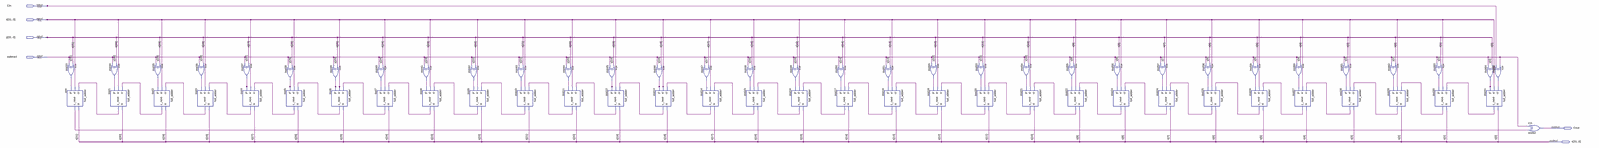
[diagram p0: schematic sheet, whole]
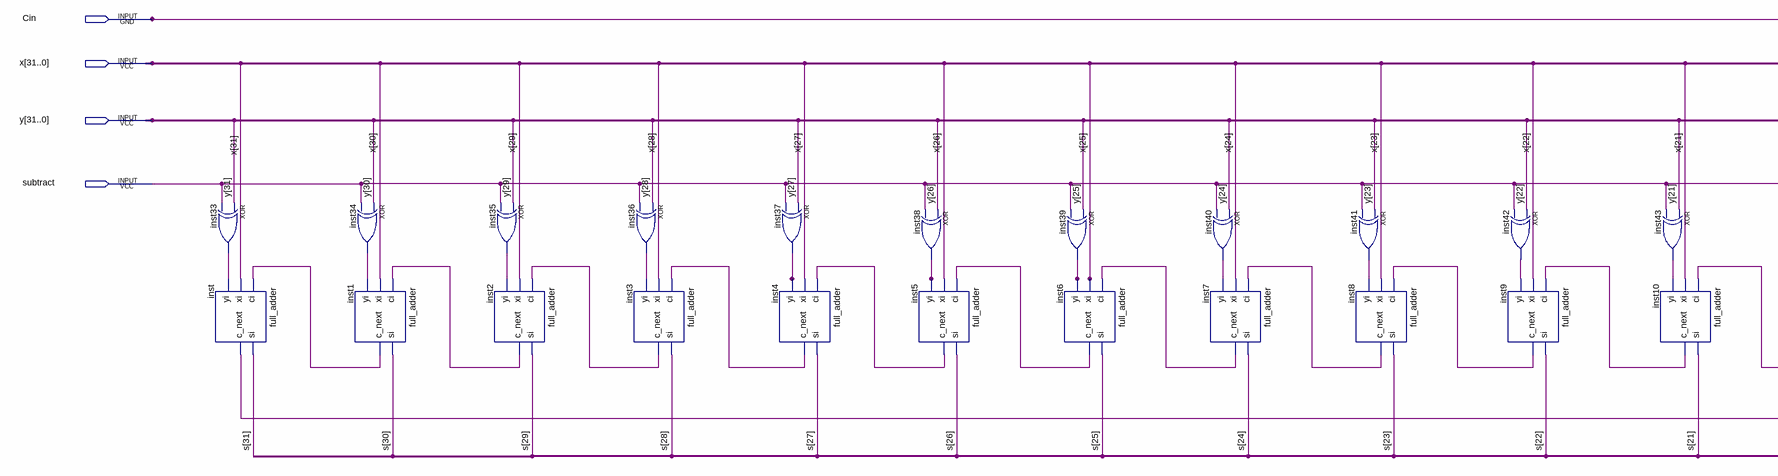
[diagram p1: schematic sheet, left part]
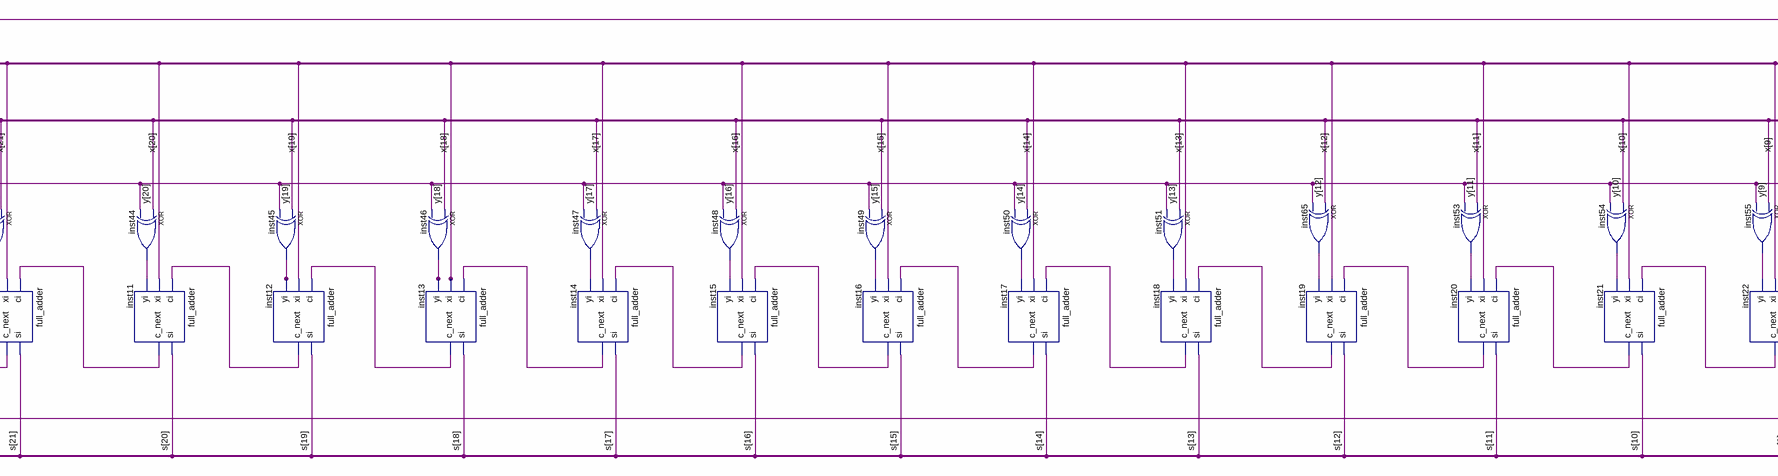
[diagram p2: schematic sheet, centre part]
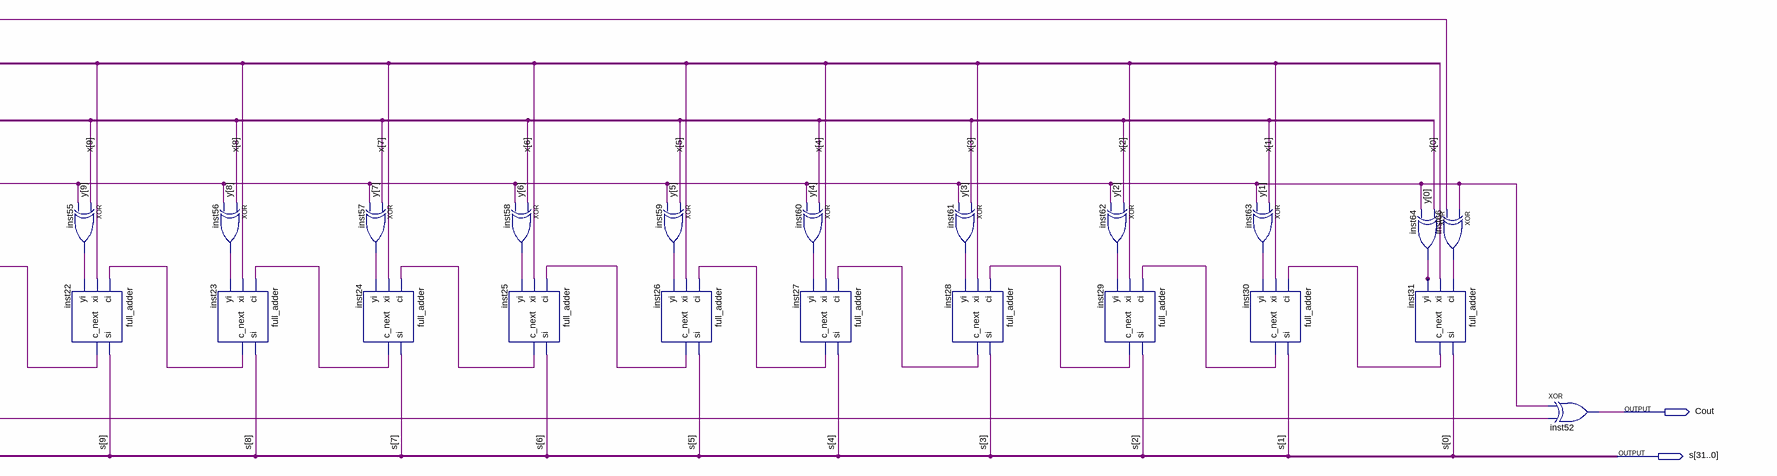
[diagram p3: schematic sheet, right part]
// Quartus schematic ripple_carry_adder.bdf as structural Verilog: 66 symbols, 6 pins
module ripple_carry_adder (
  input  Cin,
  input  [31:0] x,
  input  [31:0] y,
  input  subtract,
  output Cout,
  output [31:0] s
);

  wire inst1_c_next, inst2_c_next, inst3_c_next, inst4_c_next, inst5_c_next, inst6_c_next, inst7_c_next,
       inst8_c_next, inst9_c_next, inst10_c_next, inst11_c_next, inst12_c_next, inst13_c_next, inst14_c_next,
       inst15_c_next, inst16_c_next, inst17_c_next, inst18_c_next, inst19_c_next, inst20_c_next,
       inst21_c_next, inst22_c_next, inst23_c_next, inst24_c_next, inst25_c_next, inst26_c_next,
       inst27_c_next, inst28_c_next, inst29_c_next, inst30_c_next, inst31_c_next, inst33_out, inst34_out,
       inst35_out, inst36_out, inst37_out, inst38_out, inst39_out, inst40_out, inst41_out, inst42_out,
       inst43_out, inst44_out, inst45_out, inst46_out, inst47_out, inst48_out, inst49_out, inst50_out,
       inst51_out, inst53_out, inst54_out, inst55_out, inst56_out, inst57_out, inst58_out, inst59_out,
       inst60_out, inst61_out, inst62_out, inst63_out, inst64_out, inst65_out, inst66_out, inst_c_next;

  xor inst33 (inst33_out, y[31], subtract);
  full_adder inst (.ci(inst1_c_next), .xi(x[31]), .yi(inst33_out), .si(s[31]), .c_next(inst_c_next));
  xor inst34 (inst34_out, y[30], subtract);
  full_adder inst1 (.ci(inst2_c_next), .xi(x[30]), .yi(inst34_out), .si(s[30]), .c_next(inst1_c_next));
  xor inst35 (inst35_out, y[29], subtract);
  full_adder inst2 (.ci(inst3_c_next), .xi(x[29]), .yi(inst35_out), .si(s[29]), .c_next(inst2_c_next));
  xor inst36 (inst36_out, y[28], subtract);
  full_adder inst3 (.ci(inst4_c_next), .xi(x[28]), .yi(inst36_out), .si(s[28]), .c_next(inst3_c_next));
  xor inst37 (inst37_out, y[27], subtract);
  full_adder inst4 (.ci(inst5_c_next), .xi(x[27]), .yi(inst37_out), .si(s[27]), .c_next(inst4_c_next));
  xor inst38 (inst38_out, y[26], subtract);
  full_adder inst5 (.ci(inst6_c_next), .xi(x[26]), .yi(inst38_out), .si(s[26]), .c_next(inst5_c_next));
  xor inst39 (inst39_out, y[25], subtract);
  full_adder inst6 (.ci(inst7_c_next), .xi(x[25]), .yi(inst39_out), .si(s[25]), .c_next(inst6_c_next));
  xor inst40 (inst40_out, y[24], subtract);
  full_adder inst7 (.ci(inst8_c_next), .xi(x[24]), .yi(inst40_out), .si(s[24]), .c_next(inst7_c_next));
  xor inst41 (inst41_out, y[23], subtract);
  full_adder inst8 (.ci(inst9_c_next), .xi(x[23]), .yi(inst41_out), .si(s[23]), .c_next(inst8_c_next));
  xor inst42 (inst42_out, y[22], subtract);
  full_adder inst9 (.ci(inst10_c_next), .xi(x[22]), .yi(inst42_out), .si(s[22]), .c_next(inst9_c_next));
  xor inst43 (inst43_out, y[21], subtract);
  full_adder inst10 (.ci(inst11_c_next), .xi(x[21]), .yi(inst43_out), .si(s[21]), .c_next(inst10_c_next));
  xor inst44 (inst44_out, y[20], subtract);
  full_adder inst11 (.ci(inst12_c_next), .xi(x[20]), .yi(inst44_out), .si(s[20]), .c_next(inst11_c_next));
  xor inst45 (inst45_out, y[19], subtract);
  full_adder inst12 (.ci(inst13_c_next), .xi(x[19]), .yi(inst45_out), .si(s[19]), .c_next(inst12_c_next));
  xor inst46 (inst46_out, y[18], subtract);
  full_adder inst13 (.ci(inst14_c_next), .xi(x[18]), .yi(inst46_out), .si(s[18]), .c_next(inst13_c_next));
  xor inst47 (inst47_out, y[17], subtract);
  full_adder inst14 (.ci(inst15_c_next), .xi(x[17]), .yi(inst47_out), .si(s[17]), .c_next(inst14_c_next));
  xor inst48 (inst48_out, y[16], subtract);
  full_adder inst15 (.ci(inst16_c_next), .xi(x[16]), .yi(inst48_out), .si(s[16]), .c_next(inst15_c_next));
  xor inst49 (inst49_out, y[15], subtract);
  full_adder inst16 (.ci(inst17_c_next), .xi(x[15]), .yi(inst49_out), .si(s[15]), .c_next(inst16_c_next));
  xor inst50 (inst50_out, y[14], subtract);
  full_adder inst17 (.ci(inst18_c_next), .xi(x[14]), .yi(inst50_out), .si(s[14]), .c_next(inst17_c_next));
  xor inst51 (inst51_out, y[13], subtract);
  full_adder inst18 (.ci(inst19_c_next), .xi(x[13]), .yi(inst51_out), .si(s[13]), .c_next(inst18_c_next));
  xor inst65 (inst65_out, y[12], subtract);
  full_adder inst19 (.ci(inst20_c_next), .xi(x[12]), .yi(inst65_out), .si(s[12]), .c_next(inst19_c_next));
  xor inst53 (inst53_out, y[11], subtract);
  full_adder inst20 (.ci(inst21_c_next), .xi(x[11]), .yi(inst53_out), .si(s[11]), .c_next(inst20_c_next));
  xor inst54 (inst54_out, y[10], subtract);
  full_adder inst21 (.ci(inst22_c_next), .xi(x[10]), .yi(inst54_out), .si(s[10]), .c_next(inst21_c_next));
  full_adder inst22 (.ci(inst23_c_next), .xi(x[9]), .yi(inst55_out), .si(s[9]), .c_next(inst22_c_next));
  xor inst55 (inst55_out, y[9], subtract);
  xor inst56 (inst56_out, y[8], subtract);
  full_adder inst23 (.ci(inst24_c_next), .xi(x[8]), .yi(inst56_out), .si(s[8]), .c_next(inst23_c_next));
  xor inst57 (inst57_out, y[7], subtract);
  full_adder inst24 (.ci(inst25_c_next), .xi(x[7]), .yi(inst57_out), .si(s[7]), .c_next(inst24_c_next));
  xor inst58 (inst58_out, y[6], subtract);
  full_adder inst25 (.ci(inst26_c_next), .xi(x[6]), .yi(inst58_out), .si(s[6]), .c_next(inst25_c_next));
  xor inst59 (inst59_out, y[5], subtract);
  full_adder inst26 (.ci(inst27_c_next), .xi(x[5]), .yi(inst59_out), .si(s[5]), .c_next(inst26_c_next));
  xor inst60 (inst60_out, y[4], subtract);
  full_adder inst27 (.ci(inst28_c_next), .xi(x[4]), .yi(inst60_out), .si(s[4]), .c_next(inst27_c_next));
  xor inst61 (inst61_out, y[3], subtract);
  full_adder inst28 (.ci(inst29_c_next), .xi(x[3]), .yi(inst61_out), .si(s[3]), .c_next(inst28_c_next));
  xor inst62 (inst62_out, y[2], subtract);
  full_adder inst29 (.ci(inst30_c_next), .xi(x[2]), .yi(inst62_out), .si(s[2]), .c_next(inst29_c_next));
  xor inst63 (inst63_out, y[1], subtract);
  full_adder inst30 (.ci(inst31_c_next), .xi(x[1]), .yi(inst63_out), .si(s[1]), .c_next(inst30_c_next));
  xor inst64 (inst64_out, y[0], subtract);
  full_adder inst31 (.ci(inst66_out), .xi(x[0]), .yi(inst64_out), .si(s[0]), .c_next(inst31_c_next));
  xor inst66 (inst66_out, subtract, Cin);
  xor inst52 (Cout, subtract, inst_c_next);
endmodule
